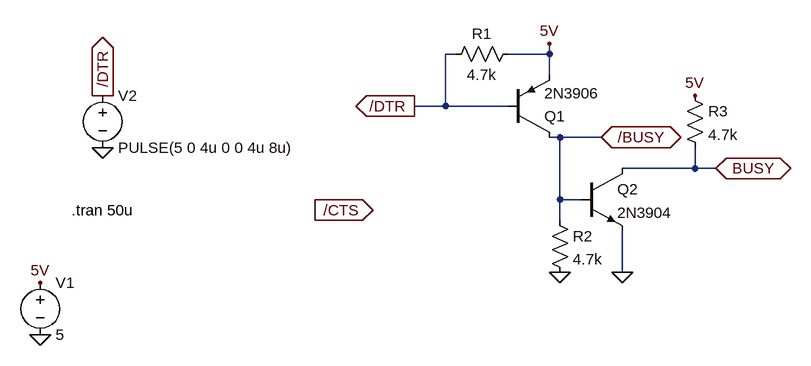
[diagram p0: schematic busy.asc]
busy.asc, the LTspice schematic file:
Version 4
SHEET 1 880 680
WIRE -160 -224 -176 -224
WIRE -16 -224 -16 -240
WIRE -16 -224 -80 -224
WIRE -16 -192 -16 -224
WIRE -176 -144 -176 -224
WIRE -176 -144 -224 -144
WIRE -80 -144 -176 -144
WIRE 0 -96 -16 -96
WIRE 64 -96 0 -96
WIRE 208 -48 208 -80
WIRE 208 -48 96 -48
WIRE 240 -48 208 -48
WIRE 0 0 0 -96
WIRE 32 0 0 0
WIRE 0 32 0 0
WIRE 96 112 96 48
FLAG -800 208 0
FLAG -800 128 5V
FLAG 64 -96 /BUSY
IOPIN 64 -96 BiDir
FLAG -704 -80 0
FLAG -704 -160 /DTR
IOPIN -704 -160 Out
FLAG -288 16 /CTS
IOPIN -288 16 In
FLAG -224 -144 /DTR
IOPIN -224 -144 Out
FLAG -16 -240 5V
FLAG 0 112 0
FLAG 240 -48 BUSY
IOPIN 240 -48 BiDir
FLAG 96 112 0
FLAG 208 -160 5V
SYMBOL voltage -800 112 R0
WINDOW 123 0 0 Left 0
WINDOW 39 0 0 Left 0
SYMATTR InstName V1
SYMATTR Value 5
SYMBOL voltage -704 -176 R0
WINDOW 123 0 0 Left 0
WINDOW 39 0 0 Left 0
SYMATTR InstName V2
SYMATTR Value PULSE(5 0 4u 0 0 4u 8u)
SYMBOL pnp -80 -96 M180
SYMATTR InstName Q1
SYMATTR Value 2N3906
SYMBOL res -176 -208 R270
WINDOW 0 32 56 VTop 2
WINDOW 3 0 56 VBottom 2
SYMATTR InstName R1
SYMATTR Value 4.7k
SYMBOL npn 32 -48 R0
SYMATTR InstName Q2
SYMATTR Value 2N3904
SYMBOL res -16 16 R0
SYMATTR InstName R2
SYMATTR Value 4.7k
SYMBOL res 192 -176 R0
SYMATTR InstName R3
SYMATTR Value 4.7k
TEXT -752 16 Left 2 !.tran 50u

The netlist it stands for:
* busy.asc
V1 5V 0 5
V2 /DTR 0 PULSE(5 0 4u 0 0 4u 8u)
Q1 /BUSY /DTR 5V 0 2N3906
R1 /DTR 5V 4.7k
Q2 BUSY /BUSY 0 0 2N3904
R2 /BUSY 0 4.7k
R3 5V BUSY 4.7k
.model NPN NPN
.model PNP PNP
.lib standard.bjt
.tran 50u
.backanno
.end

* Results of the author's LTspice run, read from the files saved beside the schematic
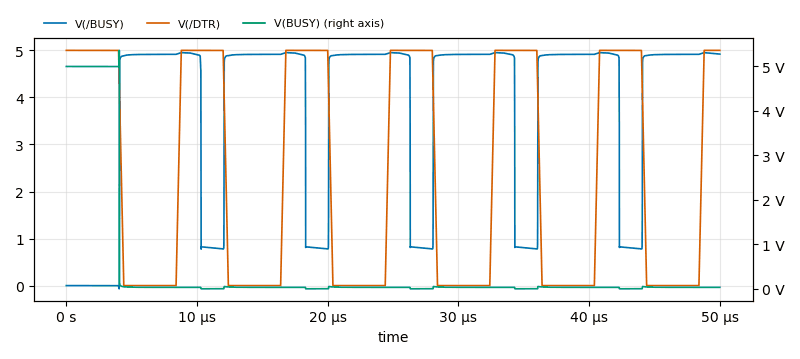
[diagram p1: Transient Analysis of busy.asc, plotted from the saved traces]
* Transient Analysis, 1 run:
*   V(/BUSY): min -68.12 m, max 4.952 , average 3.789 , rms 4.246 , last 4.921 
*   V(/DTR): min 0, max 5 , average 2.36 , rms 3.384 , last 5 
*   V(BUSY): min -137.6 µV, max 5.362 V, average 431.6 mV, rms 1.425 V, last 32.59 mV